# Altium schematic sheet NumatoShield.SchDoc
size A
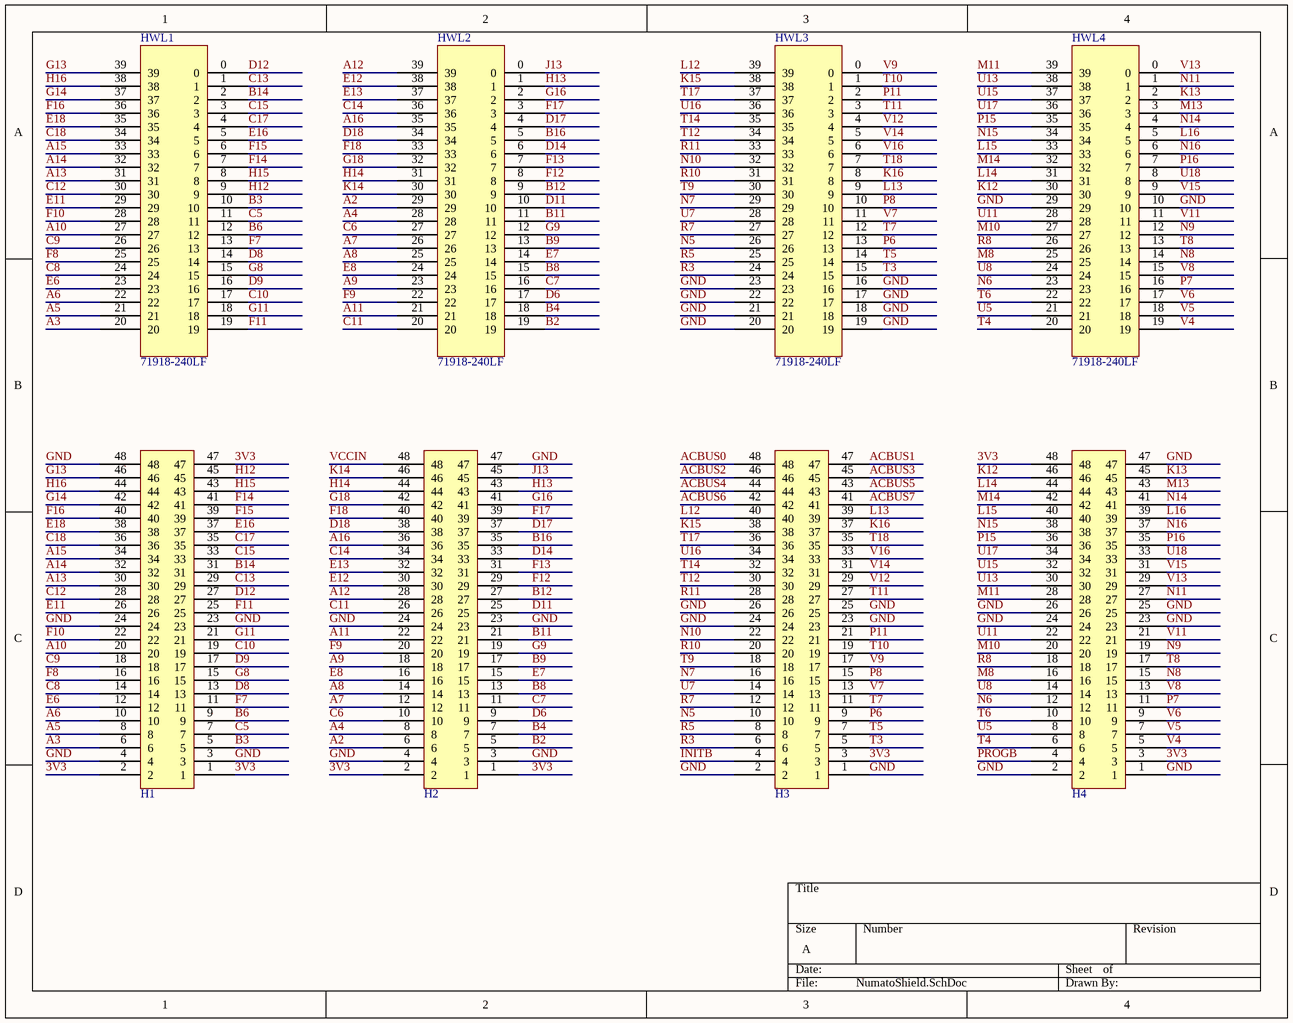
[diagram p0: NumatoShield.SchDoc]

## Parts
H1  HEADER2X48  [H_FP]  (value not drawn)
H2  HEADER2X48  [H_FP]  (value not drawn)
H3  HEADER2X48  [H_FP]  (value not drawn)
H4  HEADER2X48  [H_FP]  (value not drawn)
HWL1  71918-240LF  [HWL_FP]
HWL2  71918-240LF  [HWL_FP]
HWL3  71918-240LF  [HWL_FP]
HWL4  71918-240LF  [HWL_FP]

## Nets
3V3: H1.1 H1.2 H1.47 H2.1 H2.2 H3.3 H4.3 H4.48
A2: H2.6 HWL2.29
A3: H1.6 HWL1.20
A4: H2.8 HWL2.28
A5: H1.8 HWL1.21
A6: H1.10 HWL1.22
A7: H2.12 HWL2.26
A8: H2.14 HWL2.25
A9: H2.18 HWL2.23
A10: H1.20 HWL1.27
A11: H2.22 HWL2.21
A12: H2.28 HWL2.39
A13: H1.30 HWL1.31
A14: H1.32 HWL1.32
A15: H1.34 HWL1.33
A16: H2.36 HWL2.35
ACBUS0: H3.48
ACBUS1: H3.47
ACBUS2: H3.46
ACBUS3: H3.45
ACBUS4: H3.44
ACBUS5: H3.43
ACBUS6: H3.42
ACBUS7: H3.41
B2: H2.5 HWL2.19
B3: H1.5 HWL1.10
B4: H2.7 HWL2.18
B6: H1.9 HWL1.12
B8: H2.13 HWL2.15
B9: H2.17 HWL2.13
B11: H2.21 HWL2.11
B12: H2.27 HWL2.9
B14: H1.31 HWL1.2
B16: H2.35 HWL2.5
C5: H1.7 HWL1.11
C6: H2.10 HWL2.27
C7: H2.11 HWL2.16
C8: H1.14 HWL1.24
C9: H1.18 HWL1.26
C10: H1.19 HWL1.17
C11: H2.26 HWL2.20
C12: H1.28 HWL1.30
C13: H1.29 HWL1.1
C14: H2.34 HWL2.36
C15: H1.33 HWL1.3
C17: H1.35 HWL1.4
C18: H1.36 HWL1.34
D6: H2.9 HWL2.17
D8: H1.13 HWL1.14
D9: H1.17 HWL1.16
D11: H2.25 HWL2.10
D12: H1.27 HWL1.0
D14: H2.33 HWL2.6
D17: H2.37 HWL2.4
D18: H2.38 HWL2.34
E6: H1.12 HWL1.23
E7: H2.15 HWL2.14
E8: H2.16 HWL2.24
E11: H1.26 HWL1.29
E12: H2.30 HWL2.38
E13: H2.32 HWL2.37
E16: H1.37 HWL1.5
E18: H1.38 HWL1.35
F7: H1.11 HWL1.13
F8: H1.16 HWL1.25
F9: H2.20 HWL2.22
F10: H1.22 HWL1.28
F11: H1.25 HWL1.19
F12: H2.29 HWL2.8
F13: H2.31 HWL2.7
F14: H1.41 HWL1.7
F15: H1.39 HWL1.6
F16: H1.40 HWL1.36
F17: H2.39 HWL2.3
F18: H2.40 HWL2.33
G8: H1.15 HWL1.15
G9: H2.19 HWL2.12
G11: H1.21 HWL1.18
G13: H1.46 HWL1.39
G14: H1.42 HWL1.37
G16: H2.41 HWL2.2
G18: H2.42 HWL2.32
GND: H1.3 H1.4 H1.23 H1.24 H1.48 H2.3 H2.4 H2.23 H2.24 H2.47 H3.1 H3.2 H3.23 H3.24 H3.25 H3.26 H4.1 H4.2 H4.23 H4.24 H4.25 H4.26 H4.47 HWL3.16 HWL3.17 HWL3.18 HWL3.19 HWL3.20 HWL3.21 HWL3.22 HWL3.23 HWL4.10 HWL4.29
H12: H1.45 HWL1.9
H13: H2.43 HWL2.1
H14: H2.44 HWL2.31
H15: H1.43 HWL1.8
H16: H1.44 HWL1.38
INITB: H3.4
J13: H2.45 HWL2.0
K12: H4.46 HWL4.30
K13: H4.45 HWL4.2
K14: H2.46 HWL2.30
K15: H3.38 HWL3.38
K16: H3.37 HWL3.8
L12: H3.40 HWL3.39
L13: H3.39 HWL3.9
L14: H4.44 HWL4.31
L15: H4.40 HWL4.33
L16: H4.39 HWL4.5
M8: H4.16 HWL4.25
M10: H4.20 HWL4.27
M11: H4.28 HWL4.39
M13: H4.43 HWL4.3
M14: H4.42 HWL4.32
N5: H3.10 HWL3.26
N6: H4.12 HWL4.23
N7: H3.16 HWL3.29
N8: H4.15 HWL4.14
N9: H4.19 HWL4.12
N10: H3.22 HWL3.32
N11: H4.27 HWL4.1
N14: H4.41 HWL4.4
N15: H4.38 HWL4.34
N16: H4.37 HWL4.6
P6: H3.9 HWL3.13
P7: H4.11 HWL4.16
P8: H3.15 HWL3.10
P11: H3.21 HWL3.2
P15: H4.36 HWL4.35
P16: H4.35 HWL4.7
PROGB: H4.4
R3: H3.6 HWL3.24
R5: H3.8 HWL3.25
R7: H3.12 HWL3.27
R8: H4.18 HWL4.26
R10: H3.20 HWL3.31
R11: H3.28 HWL3.33
T3: H3.5 HWL3.15
T4: H4.6 HWL4.20
T5: H3.7 HWL3.14
T6: H4.10 HWL4.22
T7: H3.11 HWL3.12
T8: H4.17 HWL4.13
T9: H3.18 HWL3.30
T10: H3.19 HWL3.1
T11: H3.27 HWL3.3
T12: H3.30 HWL3.34
T14: H3.32 HWL3.35
T17: H3.36 HWL3.37
T18: H3.35 HWL3.7
U5: H4.8 HWL4.21
U7: H3.14 HWL3.28
U8: H4.14 HWL4.24
U11: H4.22 HWL4.28
U13: H4.30 HWL4.38
U15: H4.32 HWL4.37
U16: H3.34 HWL3.36
U17: H4.34 HWL4.36
U18: H4.33 HWL4.8
V4: H4.5 HWL4.19
V5: H4.7 HWL4.18
V6: H4.9 HWL4.17
V7: H3.13 HWL3.11
V8: H4.13 HWL4.15
V9: H3.17 HWL3.0
V11: H4.21 HWL4.11
V12: H3.29 HWL3.4
V13: H4.29 HWL4.0
V14: H3.31 HWL3.5
V15: H4.31 HWL4.9
V16: H3.33 HWL3.6
VCCIN: H2.48

## Library data of the parts
HWL1-HWL4 = 71918-240LF: CONN HEADER 40POS DUAL VERT PCB; Manufacturer: FCI; Connector Type: Header, Shrouded; Number of Positions: 40; Number of Positions Loaded: All; Pitch: 0.100" (2.54mm); Supplier 1: Digi-Key; RoHS: RoHS Compliant; Stock 1: 126; Pricing 1: 1=1.85, 10=1.677, 50=1.5054, 100=1.437, 250=1.30016, 500=1.19752, 1000=1.02645, 2500=0.95802, 5000=0.91012 (USD); Packaging: Tube; Contact Type: Male Pin; Number of Rows: 2; Row Spacing: 0.100" (2.54mm); Contact Mating Length: 0.228" (5.80mm); Mounting Type: Through Hole; Termination: Solder; Fastening Type: Latch Lock/Eject Hooks; Features: Mounting Flange; Contact Finish: Gold, GXT™; Contact Finish Thickness: 30µin (0.76µm); Color: Gray; ComponentLink1URL: http://portal.fciconnect.com/Comergent//fci/drawing/71918.pdf; ComponentLink1Description: http://portal.fciconnect.com/Comergent//fci/drawing/71918.pdf; Supplier Part Number 1: 609-4497-ND; Category: Connectors, Interconnects; Manufacturer Part Number: 71918-240LF